# Altium schematic sheet DASH_V_3_POTS.SchDoc
size A
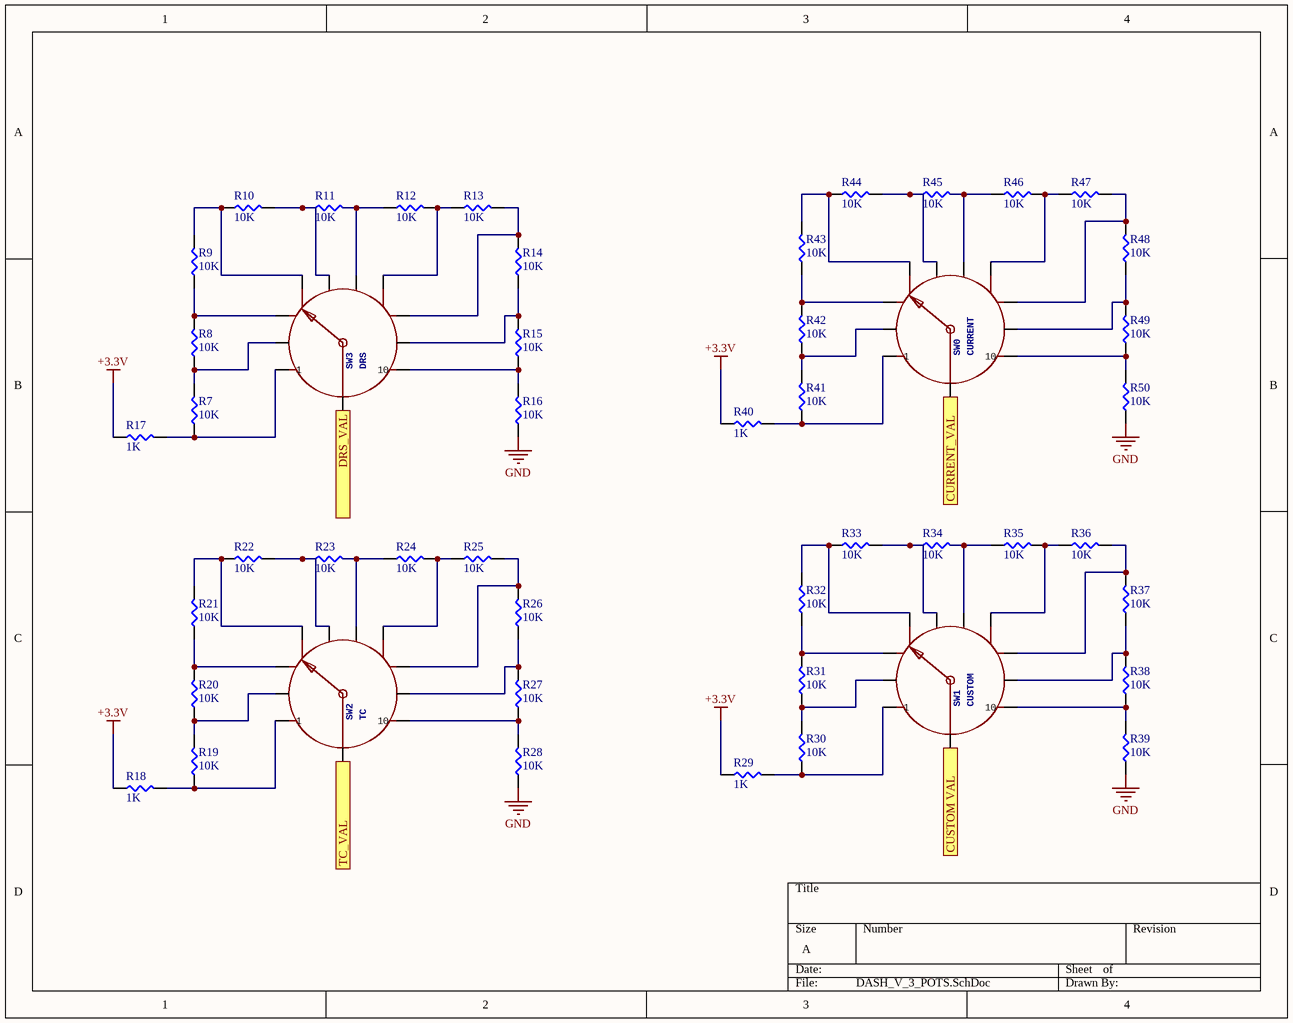
[diagram p0: DASH_V_3_POTS.SchDoc]

## Parts
R7  10K  [RES-0603]
R8  10K  [RES-0603]
R9  10K  [RES-0603]
R10  10K  [RES-0603]
R11  10K  [RES-0603]
R12  10K  [RES-0603]
R13  10K  [RES-0603]
R14  10K  [RES-0603]
R15  10K  [RES-0603]
R16  10K  [RES-0603]
R17  1K  [RES-0603]
R18  1K  [RES-0603]
R19  10K  [RES-0603]
R20  10K  [RES-0603]
R21  10K  [RES-0603]
R22  10K  [RES-0603]
R23  10K  [RES-0603]
R24  10K  [RES-0603]
R25  10K  [RES-0603]
R26  10K  [RES-0603]
R27  10K  [RES-0603]
R28  10K  [RES-0603]
R29  1K  [RES-0603]
R30  10K  [RES-0603]
R31  10K  [RES-0603]
R32  10K  [RES-0603]
R33  10K  [RES-0603]
R34  10K  [RES-0603]
R35  10K  [RES-0603]
R36  10K  [RES-0603]
R37  10K  [RES-0603]
R38  10K  [RES-0603]
R39  10K  [RES-0603]
R40  1K  [RES-0603]
R41  10K  [RES-0603]
R42  10K  [RES-0603]
R43  10K  [RES-0603]
R44  10K  [RES-0603]
R45  10K  [RES-0603]
R46  10K  [RES-0603]
R47  10K  [RES-0603]
R48  10K  [RES-0603]
R49  10K  [RES-0603]
R50  10K  [RES-0603]
SW0  CURRENT  [SPARKFUN-ELECTROMECHANICAL_ROTARY_SWITCH_1X10_KIT]
SW1  CUSTOM  [SPARKFUN-ELECTROMECHANICAL_ROTARY_SWITCH_1X10_KIT]
SW2  TC  [SPARKFUN-ELECTROMECHANICAL_ROTARY_SWITCH_1X10_KIT]
SW3  DRS  [SPARKFUN-ELECTROMECHANICAL_ROTARY_SWITCH_1X10_KIT]

## Ports
CURRENT_VAL, CUSTOM VAL, DRS_VAL, TC_VAL

## Nets
+3.3V: R17.1 R18.1 R29.1 R40.1
GND: R16.1 R28.1 R39.1 R50.1
CURRENT_VAL: SW0.COMMON ; port CURRENT_VAL
CUSTOM VAL: SW1.COMMON ; port CUSTOM VAL
DRS_VAL: SW3.COMMON ; port DRS_VAL
TC_VAL: SW2.COMMON ; port TC_VAL
NetR7_1: R7.1 R17.2 SW3.1
NetR7_2: R7.2 R8.1 SW3.2
NetR8_2: R8.2 R9.1 SW3.3
NetR9_2: R9.2 R10.1 SW3.4
NetR10_2: R10.2 R11.1 SW3.5
NetR11_2: R11.2 R12.1 SW3.6
NetR12_2: R12.2 R13.1 SW3.7
NetR13_2: R13.2 R14.2 SW3.8
NetR14_1: R14.1 R15.2 SW3.9
NetR15_1: R15.1 R16.2 SW3.10
NetR18_2: R18.2 R19.1 SW2.1
NetR19_2: R19.2 R20.1 SW2.2
NetR20_2: R20.2 R21.1 SW2.3
NetR21_2: R21.2 R22.1 SW2.4
NetR22_2: R22.2 R23.1 SW2.5
NetR23_2: R23.2 R24.1 SW2.6
NetR24_2: R24.2 R25.1 SW2.7
NetR25_2: R25.2 R26.2 SW2.8
NetR26_1: R26.1 R27.2 SW2.9
NetR27_1: R27.1 R28.2 SW2.10
NetR29_2: R29.2 R30.1 SW1.1
NetR30_2: R30.2 R31.1 SW1.2
NetR31_2: R31.2 R32.1 SW1.3
NetR32_2: R32.2 R33.1 SW1.4
NetR33_2: R33.2 R34.1 SW1.5
NetR34_2: R34.2 R35.1 SW1.6
NetR35_2: R35.2 R36.1 SW1.7
NetR36_2: R36.2 R37.2 SW1.8
NetR37_1: R37.1 R38.2 SW1.9
NetR38_1: R38.1 R39.2 SW1.10
NetR40_2: R40.2 R41.1 SW0.1
NetR41_2: R41.2 R42.1 SW0.2
NetR42_2: R42.2 R43.1 SW0.3
NetR43_2: R43.2 R44.1 SW0.4
NetR44_2: R44.2 R45.1 SW0.5
NetR45_2: R45.2 R46.1 SW0.6
NetR46_2: R46.2 R47.1 SW0.7
NetR47_2: R47.2 R48.2 SW0.8
NetR48_1: R48.1 R49.2 SW0.9
NetR49_1: R49.1 R50.2 SW0.10

## Library data of the parts
R7-R50 = RES-0603
SW0-SW3 = SPARKFUN-ELECTROMECHANICAL_SWITCH_ROTARY_1X10KIT: GateName_1: G$1; SymbolName_1: SPARKFUN-ELECTROMECHANICAL_ROTARY-SWITCH-1X10; DeviceName: KIT; PROD_ID: SWCH-12120; LibraryName: Rotary_Switch_Potentiometer_v10; DeviceSetName: SPARKFUN-ELECTROMECHANICAL_SWITCH_ROTARY_1X10; Package: SPARKFUN-ELECTROMECHANICAL_ROTARY_SWITCH_1X10_KIT